# EAGLE schematic sensor_node_v1 (EAGLE 7.2.0)
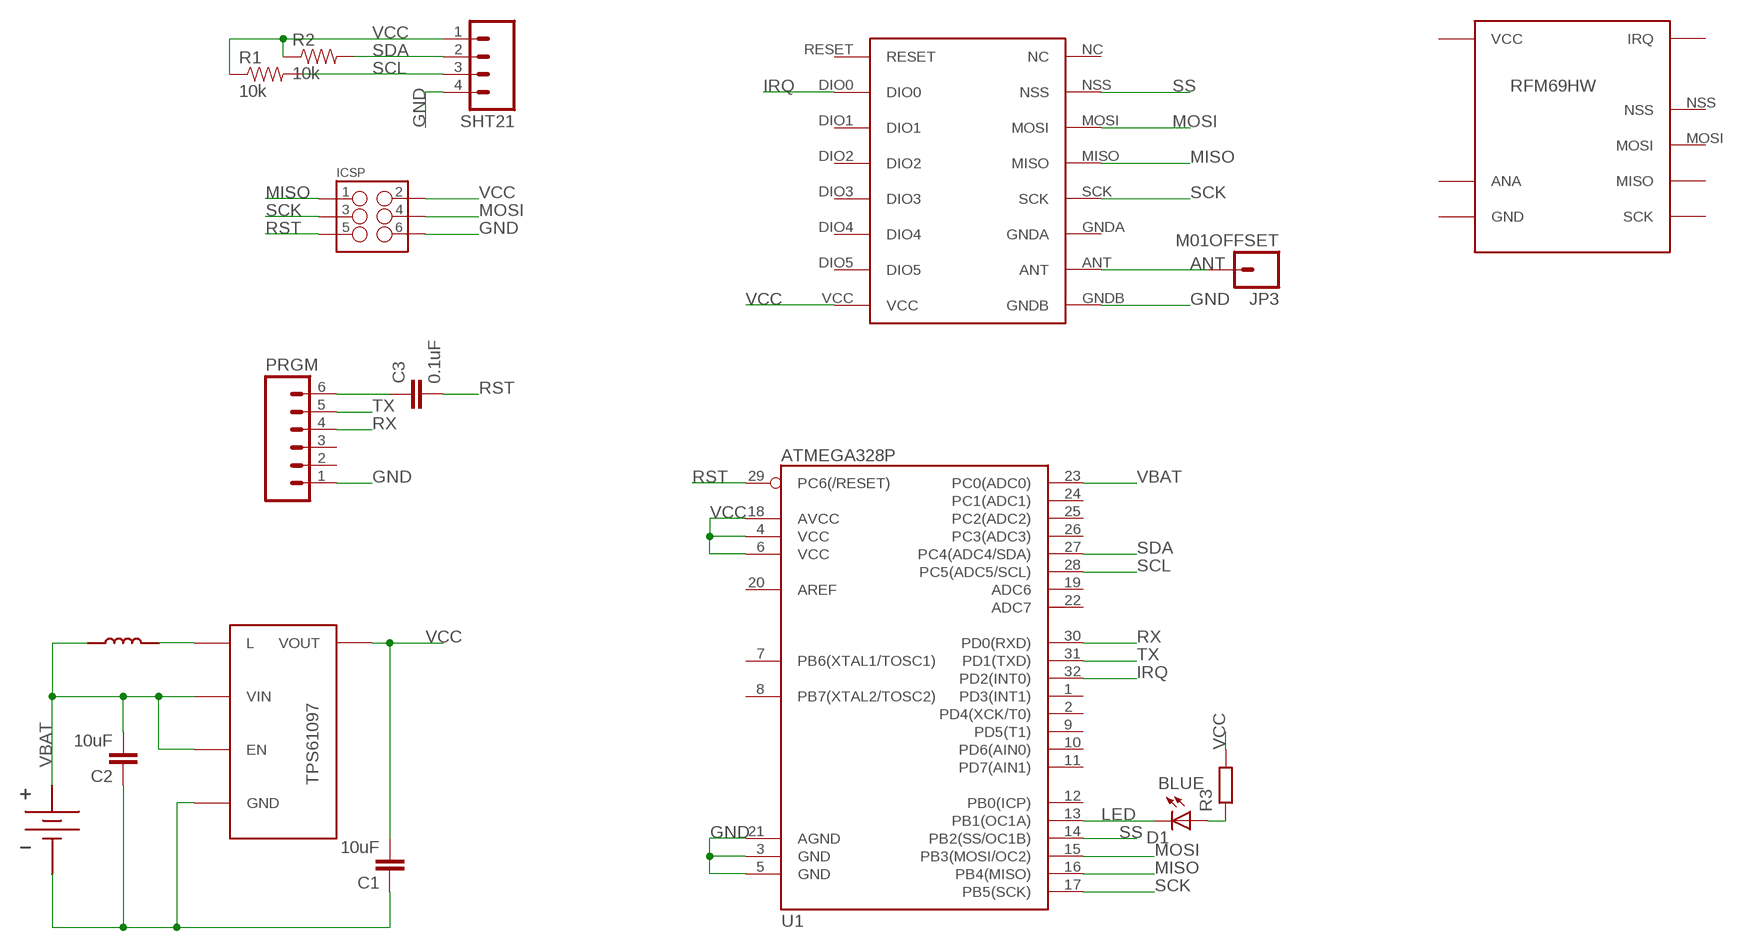
[diagram p0: schematic, sheet 1]

## Parts
C1  10uF  10UF-6.3V-20%(0603)  [0603-CAP]
C2  10uF  10UF-6.3V-20%(0603)  [0603-CAP]
C3  0.1uF  0.22UF50V-20%,+80%(0603)  [0603-CAP]
D1  BLUE  LED-BLUE0603  [LED-0603]
ICSP  M03X2FEMALE_SMD  [2X3_SMD]
JP3  M01OFFSET  [1X01_OFFSET]
PRGM  M06LOCK_LONGPADS  [1X06_LOCK_LONGPADS]
R1  10k  2.0KOHM1/10W5%(0603)  [0603-RES]
R2  10k  2.0KOHM1/10W5%(0603)  [0603-RES]
R3  RESISTOR0603-N  [R0603-N]
RFM69HW  RFM69HW  [RFM]
SHT21  M04LOCK_LONGPADS  [1X04_LOCK_LONGPADS]
U1  ATMEGA328P  ATMEGA328_SMT  [TQFP32-08]
U$1  KEYSTONEAAHOLDER_2CELL  [KEYSTONEAAHOLDER_2CELL]
U$2  TPS61097-33  [SOT23-5]
U$3  COILCRAFT_DO3314  [COILCRAFT_DO3314]
U$4  RFM69HW_MIN  [RFM69]

## Nets
ANT: JP3.1 RFM69HW.ANT
GND: C1.1 C2.1 ICSP.6 PRGM.1 RFM69HW.GNDB SHT21.4 U1.3(GND) U1.5(GND) U1.21(AGND) U$1.P$2(GND) U$2.P$2(GND)
IRQ: RFM69HW.DIO0 U1.32(PD2(INT0))
LED: D1.C U1.13(PB1(OC1A))
MISO: ICSP.1 RFM69HW.MISO U1.16(PB4(MISO))
MOSI: ICSP.4 RFM69HW.MOSI U1.15(PB3(MOSI/OC2))
N$1: U$2.P$5(L) U$3.P$1
N$2: C3.1 PRGM.6
N$3: D1.A R3.1
RST: C3.2 ICSP.5 U1.29(PC6(/RESET))
RX: PRGM.4 U1.30(PD0(RXD))
SCK: ICSP.3 RFM69HW.SCK U1.17(PB5(SCK))
SCL: R1.2 SHT21.3 U1.28(PC5(ADC5/SCL))
SDA: R2.2 SHT21.2 U1.27(PC4(ADC4/SDA))
SS: RFM69HW.NSS U1.14(PB2(SS/OC1B))
TX: PRGM.5 U1.31(PD1(TXD))
VBAT: C2.2 U1.23(PC0(ADC0)) U$1.P$1(VBAT) U$2.P$1(VIN) U$2.P$3(EN) U$3.P$2
VCC: C1.2 ICSP.2 R1.1 R2.1 R3.2 RFM69HW.VCC SHT21.1 U1.4(VCC) U1.6(VCC) U1.18(AVCC) U$2.P$4(VOUT)
Unconnected: PRGM.2 PRGM.3 RFM69HW.DIO1 RFM69HW.DIO2 RFM69HW.DIO3 RFM69HW.DIO4 RFM69HW.DIO5 RFM69HW.GNDA RFM69HW.NC RFM69HW.RESET U1.1(PD3(INT1)) U1.2(PD4(XCK/T0)) U1.7(PB6(XTAL1/TOSC1)) U1.8(PB7(XTAL2/TOSC2)) U1.9(PD5(T1)) U1.10(PD6(AIN0)) U1.11(PD7(AIN1)) U1.12(PB0(ICP)) U1.19(ADC6) U1.20(AREF) U1.22(ADC7) U1.24(PC1(ADC1)) U1.25(PC2(ADC2)) U1.26(PC3(ADC3)) U$4.ANA U$4.DIO0(IRQ) U$4.GND U$4.MISO U$4.MOSI U$4.NSS U$4.SCK U$4.VCC

## Library data of the parts
C1 C2 = SparkFun-Capacitors:10UF-6.3V-20%(0603): CAP-11015; PROD_ID: CAP-11015
C3 = SparkFun-Capacitors:0.22UF50V-20%,+80%(0603): CAP-09885; PROD_ID: CAP-09885; VALUE: 0.22uF
D1 = SparkFun-LED:LED-BLUE: Blue LEDs for production use Various blue LEDs stocked by SparkFun production 0603 - DIO-08575 Rebel - DIO-09553 1206 - DIO-09911; PROD_ID: DIO-08575
ICSP = SparkFun-Connectors:M03X2: 2x3 .1" header. Shrouded, with keying- CONN-10681 SMT- CONN-11415 Pogo pins- HW-11044; PROD_ID: CONN-11290
JP3 = SparkFun-Connectors:M01: Header 1 Standard 1-pin 0.1" header. Use with straight break away headers (SKU : PRT-00116), right angle break away headers (PRT-00553), swiss pins (PRT-00743), machine pins (PRT-00117), and female headers (PRT-00115).
PRGM = SparkFun-Connectors:M06: Header 6 Standard 6-pin 0.1" header. Use with straight break away headers (SKU : PRT-00116), right angle break away headers (PRT-00553), swiss pins (PRT-00743), machine pins (PRT-00117), and female headers (PRT-00115). Molex polarized connector foot print use with SKU : PRT-08094 with associated crimp pins and housings. NOTES ON THE VARIANTS LOCK and LOCK_LONGPADS... This footprint was designed to help hold the alignment of a through-hole component (i.e. 6-pin header) while soldering it into place. You may notice that each hole has been shifted either up or down by 0.005 of an inch from it's more standard position (which is a perfectly straight line). This slight alteration caused the pins (the squares in the middle) to touch the edges of the holes. Because they are alternating, it causes a "brace" to hold the component in place. 0.005 has proven to be the perfect amount of "off-center" position when using our standard breakaway headers. Although looks a little odd when you look at the bare footprint, once you have a header in there, the alteration is very hard to notice. Also,if you push a header all the way into place, it is covered up entirely on the bottom side. This idea of altering the position of holes to aid alignment will be further integrated into the Sparkfun Library for other footprints. It can help hold any component with 3 or more connection pins.
R1 R2 = SparkFun-Resistors:2.0KOHM1/10W5%(0603): RES-08296; PROD_ID: RES-08296; VALUE: 2.0k
R3 = passives-7351:RESISTOR
RFM69HW = hoperf:RFM69HW
SHT21 = SparkFun-Connectors:M04: Header 4 Standard 4-pin 0.1" header. Use with straight break away headers (SKU : PRT-00116), right angle break away headers (PRT-00553), swiss pins (PRT-00743), machine pins (PRT-00117), and female headers (PRT-00115). Molex polarized connector foot print use with SKU : PRT-08231 with associated crimp pins and housings. 1MM SMD Version SKU: PRT-10208
U1 = SparkFun-DigitalIC:ATMEGA328_SMT: 32-Pin Atmega328 part Commonly used on Arduino compatible boards Available in QFP and QFN packages TQFP is IC-09069 QFN is non-stock; PROD_ID: IC-09069
U$1 = myRandomThings:KEYSTONEAAHOLDER_2CELL
U$2 = myRandomThings:TPS61097-33
U$3 = myRandomThings:COILCRAFT_DO3314
U$4 = hoperf:RFM69HW_MIN